# EAGLE design wemos-br1-board (EAGLE 7.7.0)
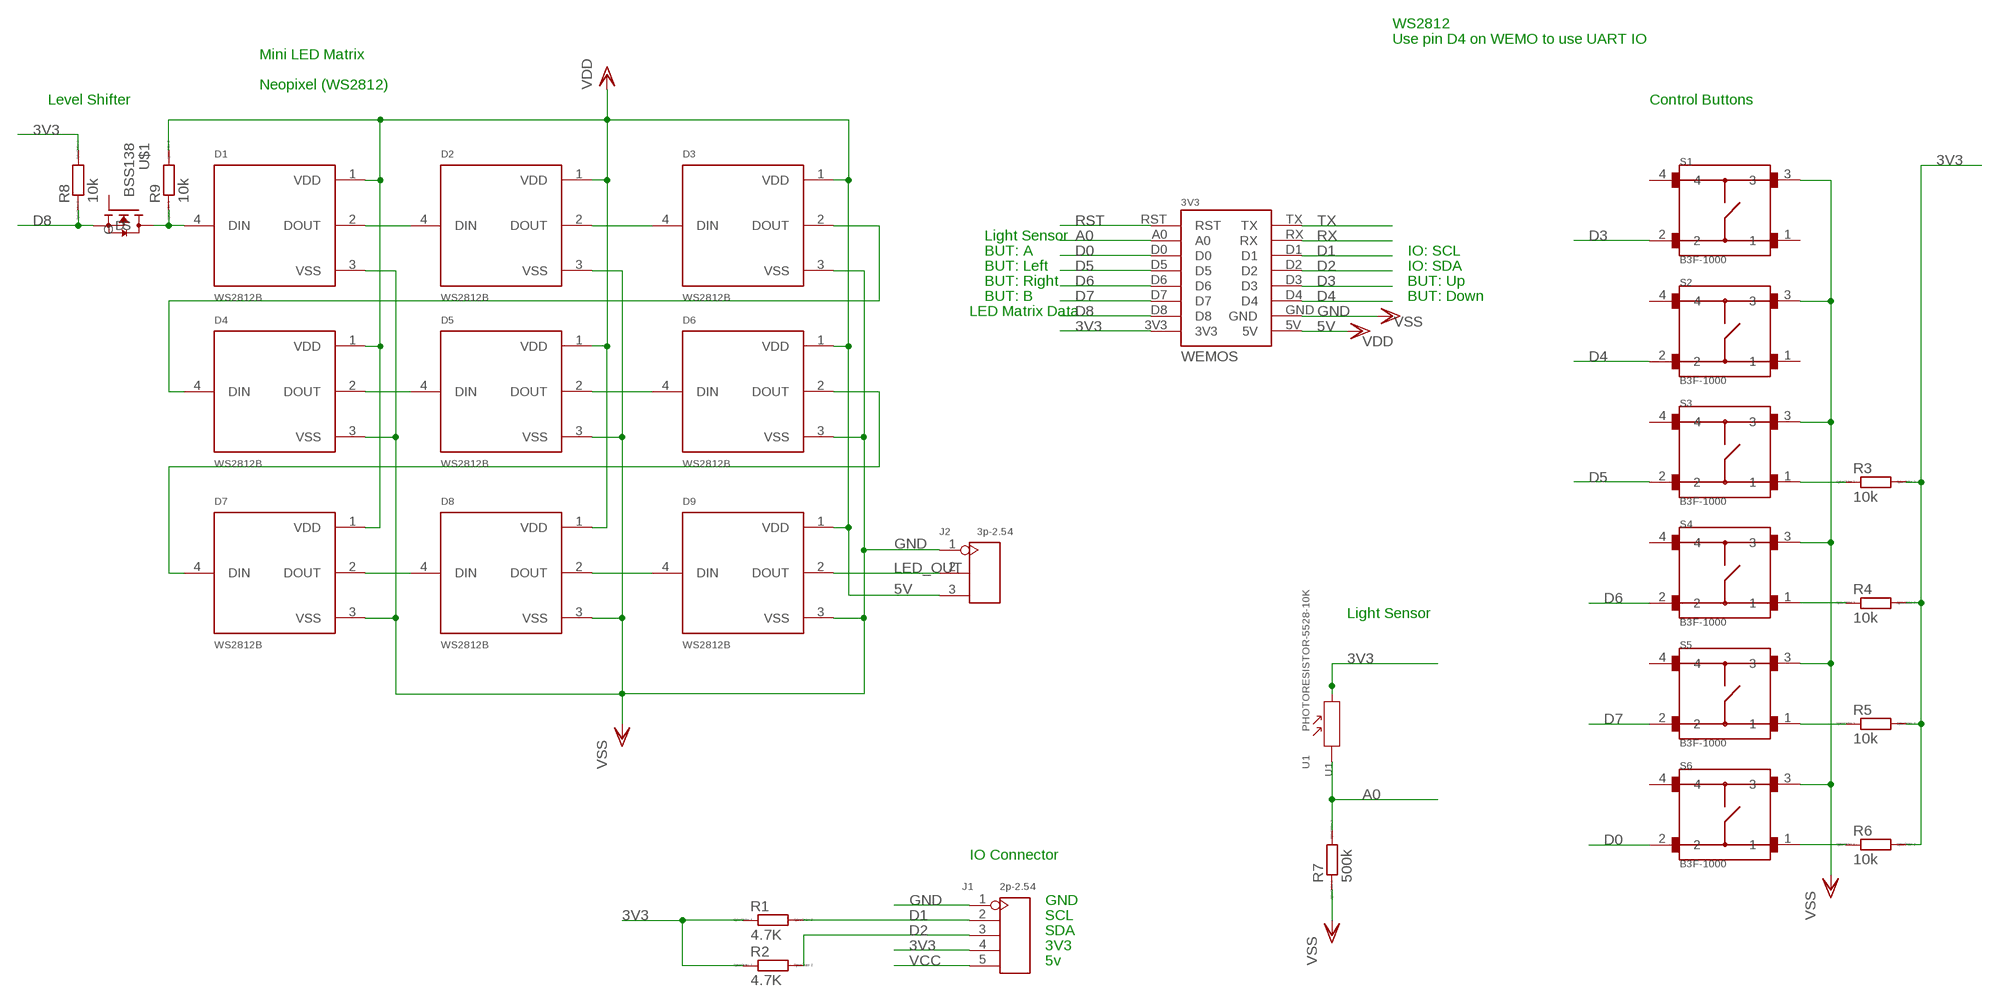
[diagram p0: schematic, sheet 1]

## Parts
3V3  WEMOS  [WEMOS]
D1  WS2812B  [LED_WS2812B]
D2  WS2812B  [LED_WS2812B]
D3  WS2812B  [LED_WS2812B]
D4  WS2812B  [LED_WS2812B]
D5  WS2812B  [LED_WS2812B]
D6  WS2812B  [LED_WS2812B]
D7  WS2812B  [LED_WS2812B]
D8  WS2812B  [LED_WS2812B]
D9  WS2812B  [LED_WS2812B]
J1  2p-2.54  DIP-BLACK-MALE-HEADER-VERT(5P-2.54)  [H5-2.54]
J2  3p-2.54  DIP-BLACK-FEMALE-HEADER-VERT(3P-2.54)  [H3-2.54]
R1  4.7K  R  [R0805]
R2  4.7K  R  [R0805]
R3  10k  R  [R0805]
R4  10k  R  [R0805]
R5  10k  R  [R0805]
R6  10k  R  [R0805]
R7  500k  R  [R0805]
R8  10k  R  [R0805]
R9  10k  R  [R0805]
S1  B3F-1000  [SW_B3F-1000]
S2  B3F-1000  [SW_B3F-1000]
S3  B3F-1000  [SW_B3F-1000]
S4  B3F-1000  [SW_B3F-1000]
S5  B3F-1000  [SW_B3F-1000]
S6  B3F-1000  [SW_B3F-1000]
U1  PHOTORESISTOR-5528-10K  PHOTORESISTOR-5528-10K(2P-5.0X4.2MM)  [SNR2-3.0]
U$1  BSS138  [BSS138]

## Nets
3V3: 3V3.3V3 J1.4 R1.1 R2.1 R3.2 R4.2 R5.2 R6.2 R8.2 U1.2
5V: 3V3.5V D1.1(VDD) D2.1(VDD) D3.1(VDD) D4.1(VDD) D5.1(VDD) D6.1(VDD) D7.1(VDD) D8.1(VDD) D9.1(VDD) J2.3 R9.2 ; supply symbol labelled VDD
A0: 3V3.A0 R7.2 U1.1
D0: 3V3.D0 S6.2
D1: 3V3.D1 J1.2 R1.2
D2: 3V3.D2 J1.3 R2.2
D3: 3V3.D3 S1.2
D4: 3V3.D4 S2.2
D5: 3V3.D5 S3.2
D6: 3V3.D6 S4.2
D7: 3V3.D7 S5.2
D8: 3V3.D8 R8.1 U$1.S
GND: 3V3.GND D1.3(VSS) D2.3(VSS) D3.3(VSS) D4.3(VSS) D5.3(VSS) D6.3(VSS) D7.3(VSS) D8.3(VSS) D9.3(VSS) J1.1 J2.1 R7.1 S1.3 S2.3 S3.3 S4.3 S5.3 S6.3 ; supply symbol labelled VSS
LED_OUT: D9.2(DOUT) J2.2
N$1: R3.1 S3.1
N$2: D1.2(DOUT) D2.4(DIN)
N$3: D2.2(DOUT) D3.4(DIN)
N$4: D3.2(DOUT) D4.4(DIN)
N$5: D4.2(DOUT) D5.4(DIN)
N$6: D5.2(DOUT) D6.4(DIN)
N$7: D6.2(DOUT) D7.4(DIN)
N$8: D7.2(DOUT) D8.4(DIN)
N$9: D8.2(DOUT) D9.4(DIN)
N$10: R4.1 S4.1
N$11: R5.1 S5.1
N$12: R6.1 S6.1
N$15: D1.4(DIN) R9.1 U$1.D
RST: 3V3.RST
RX: 3V3.RX
TX: 3V3.TX
VCC: J1.5
Unconnected: S1.1 S1.4 S2.1 S2.4 S3.4 S4.4 S5.4 S6.4 U$1.G

## Notes on the sheet
- WS2812 
  Use pin D4 on WEMO to use UART IO
- Mini LED Matrix
- Neopixel (WS2812)
- Level Shifter | Control Buttons
- Light Sensor
- BUT: A | IO: SCL
- BUT: Left | IO: SDA
- BUT: Right | BUT: Up
- BUT: B | BUT: Down
- LED Matrix Data
- Light Sensor
- IO Connector
- GND
- SCL
- SDA
- 3V3
- 5v

## Library data of the parts
3V3 = 1455413453956-wemos:WEMOS
D1-D9 = WS2812B:WS2812B: Ws2812b 5050 Rgb Led With Integrated Driver Chip Pack Of 10; AVAILABILITY: Warning; DESCRIPTION: Intelligent Control Led Integrated Light Source Pack Of 10; MF: Adafruit Industries; MP: WS2812B; PACKAGE: None; PRICE: 5.56 USD
J1 = Seeed-OPL-Connector:DIP-BLACK-MALE-HEADER-VERT(5P-2.54): 320020040
J2 = Seeed-OPL-Connector:DIP-BLACK-FEMALE-HEADER-VERT(3P-2.54): 320030024; MPN: F185-1103A0BSYA1
R1-R9 = eagle-ltspice:R: RESISTOR, European symbol; SPICEMODEL: NONE; SPICEPREFIX: R
S1-S6 = B3F-1000:B3F-1000: Switch, FLUX TIGHT MECHANICAL KEYSwitch, , 50MA@24VDC, NO GROUND TERM., FLAT PLUNG; AVAILABILITY: Good; DESCRIPTION: Switch, FLUX TIGHT MECHANICAL KEYSwitch, , 50MA@24VDC, NO GROUND TERM., FLAT PLUNG; MF: Omron; MP: B3F-1000; PACKAGE: None; PRICE: 0.23 USD
U1 = Seeed-OPL-sensor:PHOTORESISTOR-5528-10K(2P-5.0X4.2MM): 314020017; MPN: PHOTORESISTOR-5528-10K
U$1 = BSS138:BSS138: BSS138 N-Channel Logic Level Enhancement Mode Field Effect Transistor; AVAILABILITY: Good; DESCRIPTION: B138 Series 50 V 6 Ohms N-Ch Logic Level Enhancement Mode FET - SOT-23-3; MF: Fairchild Semiconductor; MP: BSS138; PACKAGE: SOT-23-3 Fairchild Semiconductor; PRICE: 0.09 USD

## Board
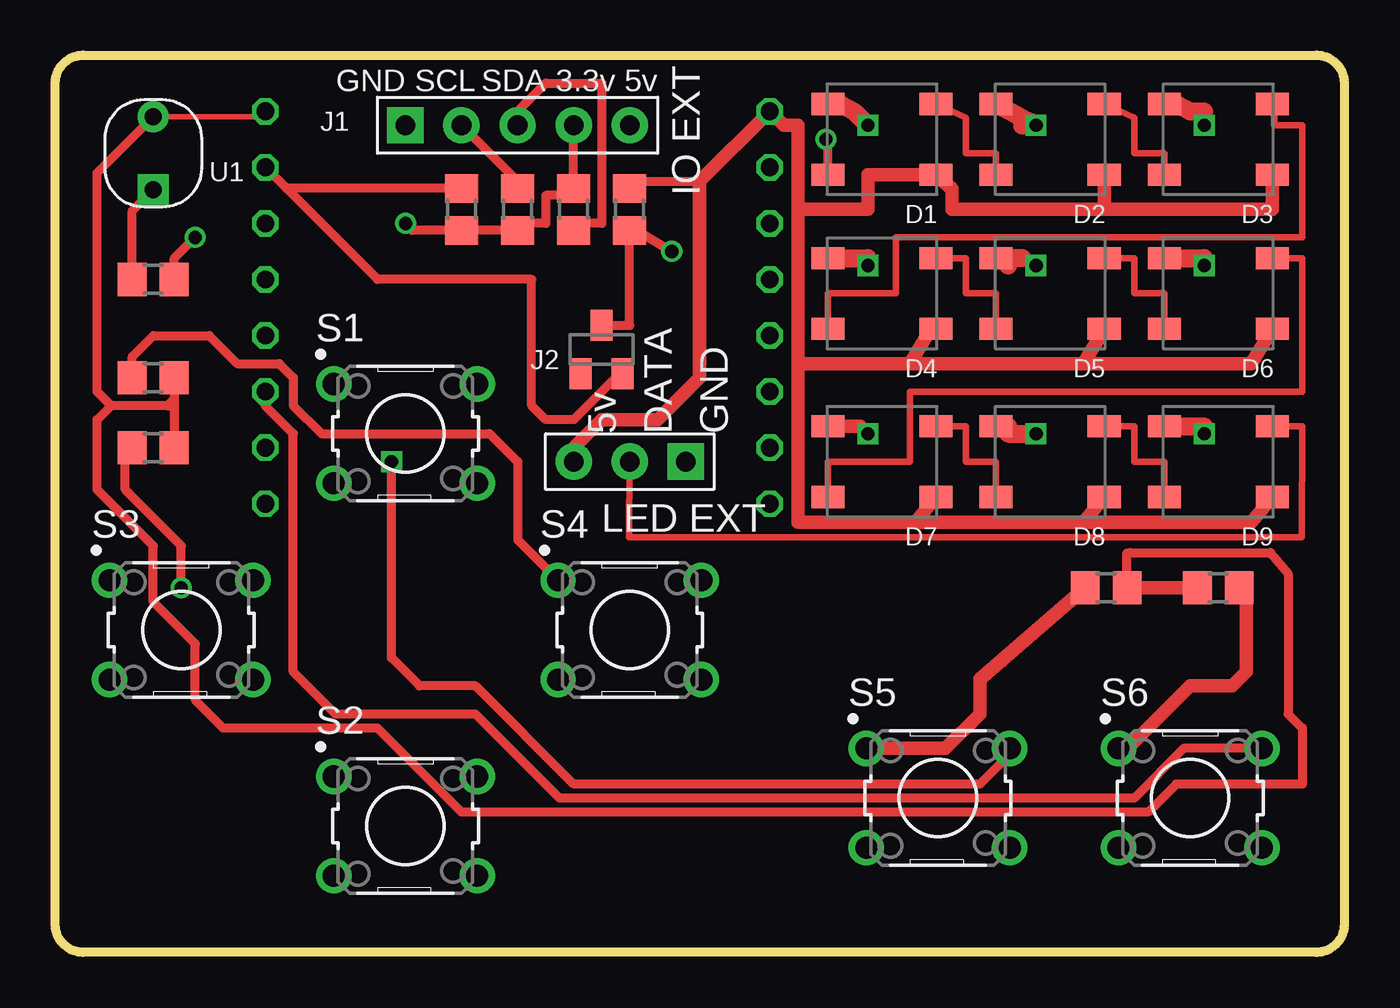
[diagram p1: board, top side]
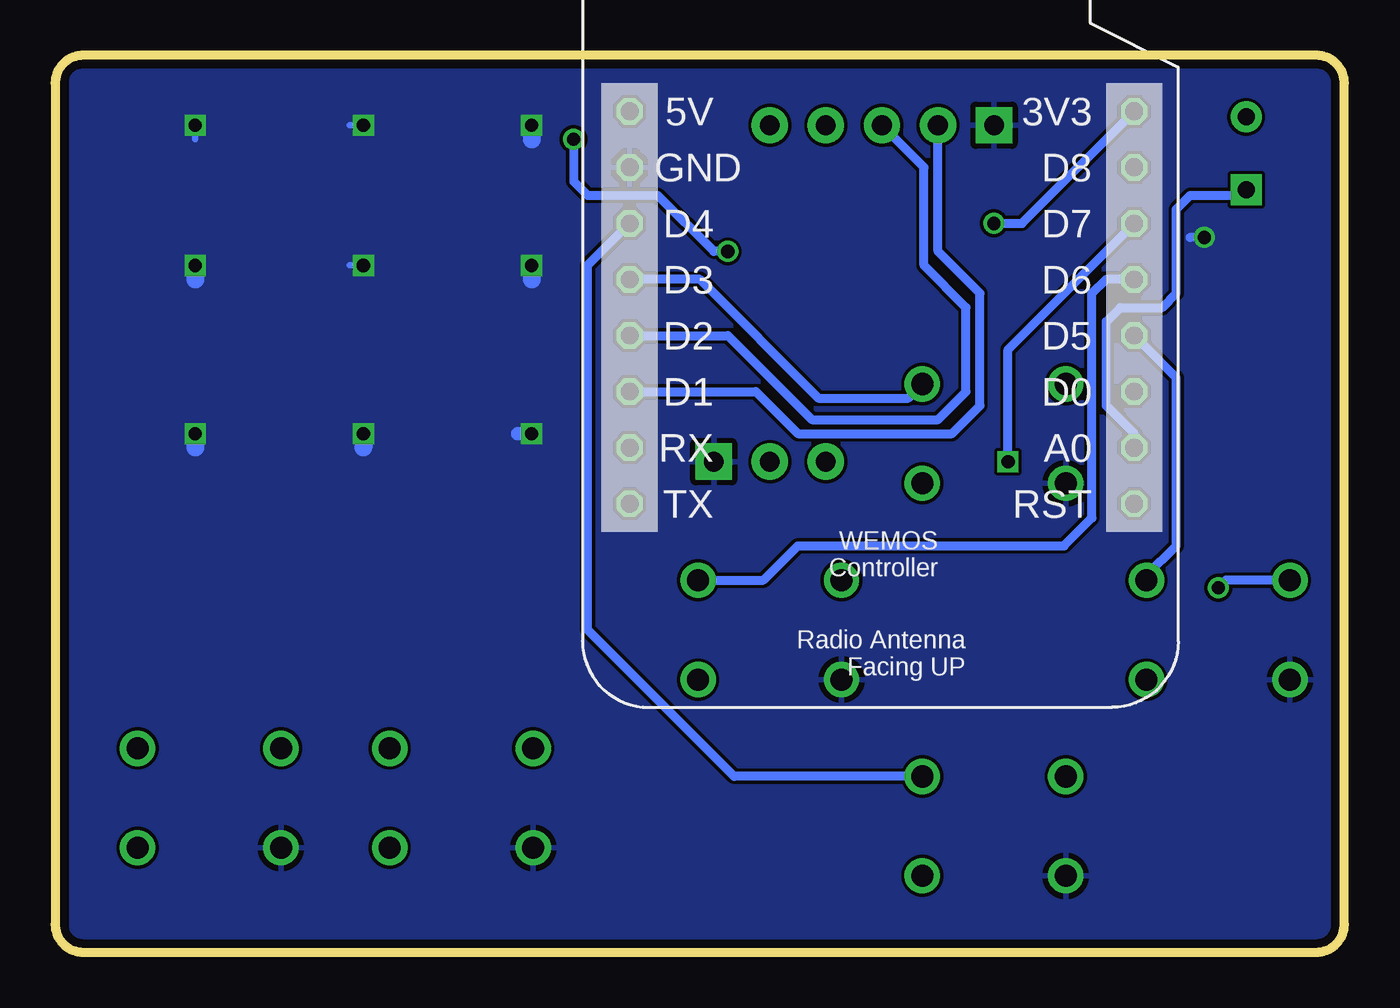
[diagram p2: board, bottom side, seen from below]

Size 58.42 x 40.64 mm. Coordinates in mm from the lower left corner, seen from the top.
Outline: 1.27,40.64 57.15,40.64 arc-90 58.42,39.37 58.42,1.27 arc-90 57.15,0 1.27,0 arc-90 0,1.27 0,39.37 arc-90 1.27,40.64
Copper layers (1*16): Top 0.0356mm / dielectric 1.5011mm / Bottom 0.0356mm
Design rules "LaenPCBOrder": minimum track width 6mil, minimum drill 13mil, track to track 6mil, track to pad 6mil, pad to pad 6mil, via to via 6mil, smd to smd 6mil, copper to edge 15mil, drill to drill 6mil, minimum pad ring 7mil, minimum via ring 7mil, stop-mask expansion 3mil, vias tented up to drill 0mil, thermal gap 10mil

### Footprints (pad centres in the part's own frame; a part is rotated, then mirrored left to right if it is on the bottom)
WEMOS = drill 0.8 octagon: 3V3 0,0; 5V 22.86,0; A0 0,15.24; D0 0,12.7; D1 22.86,12.7; D2 22.86,10.16; D3 22.86,7.62; D4 22.86,5.08; D5 0,10.16; D6 0,7.62; D7 0,5.08; D8 0,2.54; GND 22.86,2.54; RST 0,17.78; RX 22.86,15.24; TX 22.86,17.78
LED_WS2812B = smd 1.5 x 1: 1 -2.45,1.6; 2 -2.45,-1.6; 3 2.45,-1.6; 4 2.45,1.6
H5-2.54 = drill 0.889 pad 1.651 square: 1 0,5.08 | drill 0.889 pad 1.651: 2 0,2.54; 3 0,0; 4 0,-2.54; 5 0,-5.08
H3-2.54 = drill 0.889 pad 1.651 square: 1 0,2.54 | drill 0.889 pad 1.651: 2 0,0; 3 0,-2.54
R0805 = smd 1.3 x 1.5: 1 -0.95,0; 2 0.95,0
SW_B3F-1000 = drill 1 pad 1.6: 1 -3.25,2.25; 2 3.25,2.25; 3 -3.25,-2.25; 4 3.25,-2.25
SNR2-3.0 = drill 0.762 pad 1.397 square: 1 -1.651,0 | drill 0.762 pad 1.397: 2 1.651,0
BSS138 = smd 1 x 1.4: D 0,1.1; G -0.95,-1.1; S 0.95,-1.1

### Placement (x,y rotation side)
3V3  9.53,38.1 180 bottom
D1  37.47,36.83 180 top
D2  45.08,36.83 180 top
D3  52.7,36.83 180 top
D4  37.47,29.84 180 top
D5  45.08,29.84 180 top
D6  52.7,29.84 180 top
D7  37.47,22.23 180 top
D8  45.08,22.23 180 top
D9  52.7,22.23 180 top
J1  20.96,37.46 90 top
J2  26.04,22.23 270 top
R1  20.96,33.66 90 top
R2  23.5,33.66 270 top
R3  4.45,22.86 0 top
R4  4.45,26.04 0 top
R5  47.62,16.51 0 top
R6  52.7,16.51 180 top
R7  4.45,30.48 180 top
R8  18.41,33.66 270 top
R9  26.04,33.66 90 top
S1  15.88,23.5 0 top
S2  15.88,5.72 0 top
S3  5.71,14.61 0 top
S4  26.04,14.61 0 top
S5  40,6.98 0 top
S6  51.44,6.98 0 top
U1  4.45,36.2 90 top
U$1  24.77,27.3 0 top

### Tracks (layer width: path | path; a pad name or v marks a point on that pad's centre or on a via)
3V3  (via drill 0.6)
  Top 0.254: U1.2 9.53,37.85 3V3.3V3
  Top 0.406: 5.39,24.77 R4.2 5.39,25.08 5.08,24.77 | 5.39,24.77 R3.2 | R5.2 48.58,18.1 48.72,18.11 55.07,18.11 55.88,17.15 55.88,10.8 56.52,10.16 56.52,7.62 50.8,7.62 49.53,6.35 18.41,6.35 14.61,10.16 7.62,10.16 6.35,11.43 6.35,13.97 4.45,15.88 4.45,18.41 1.91,20.96 1.91,24.13 2.54,24.77 | J1.4 R2.1 23.5,34.29 22.23,34.29 22.23,33.02 20.96,33.02 R1.1 R8.2 16.19,32.71 v15.88,33.02 | 5.08,24.77 5.39,24.77 | 5.08,24.77 2.54,24.77 | 2.54,24.77 1.91,25.4 1.91,35.31 U1.2
  Top 0.61: R5.2 R6.2
  Bottom 0.406: v15.88,33.02 14.61,33.02 3V3.3V3
5V
  Top 0.406: R9.2 26.04,34.93 29.21,34.93
  Top 0.61: 47.53,33.66 40.64,33.66 40.64,34.6 D1.1 36.83,35.23 36.83,33.66 33.66,33.66 | 47.53,33.66 D2.1 | 47.53,33.66 55.16,33.66 D3.1 | 33.66,33.66 33.66,37.46 33.02,37.46 3V3.5V 29.21,34.93 29.21,26.04 27.31,24.13 24.77,24.13 23.5,22.86 J2.3 | D4.1 39.67,28.25 38.73,26.67 | 38.73,26.67 33.66,26.67 | 33.66,26.67 33.66,33.66 | 38.73,26.67 46.59,26.67 | 46.59,26.67 D5.1 | 46.59,26.67 54.22,26.67 D6.1 | 33.66,26.67 33.66,19.48 38.97,19.48 | 38.97,19.48 D7.1 | 38.97,19.48 46.59,19.48 | 46.59,19.48 D8.1 | 46.59,19.48 54.22,19.48 D9.1
A0
  Top 0.406: R7.2 3.5,33.59 U1.1
  Bottom 0.406: 3V3.A0 9.53,23.5 10.8,24.77 10.8,28.58 10.16,29.21 8.26,29.21 7.62,29.84 7.62,33.66 6.98,34.29 4.7,34.29 U1.1
D0
  Top 0.406: S6.2 51.14,9.23 48.89,6.98 22.86,6.98 19.05,10.8 12.7,10.8 10.8,12.7 10.8,23.5 9.53,24.77 3V3.D0
D1
  Top 0.406: R1.2 20.96,34.93 J1.2
  Bottom 0.406: 3V3.D1 26.67,25.4 24.77,23.5 17.78,23.5 16.51,24.77 16.51,29.84 18.41,31.75 J1.2
D2
  Top 0.406: J1.3 20.96,38.1 22.23,39.37 24.77,39.37 24.77,33.02 23.5,33.02 R2.2
  Bottom 0.406: 3V3.D2 27.94,27.94 24.13,24.13 18.41,24.13 17.14,25.4 17.14,29.21 19.05,31.12 19.05,35.56 J1.3
D3
  Bottom 0.406: 3V3.D3 29.21,30.48 23.84,25.11 19.76,25.11 S1.2
D4
  Bottom 0.406: S2.2 27.65,7.97 34.29,14.61 34.29,31.12 3V3.D4
D5
  Bottom 0.406: S3.2 8.96,17.07 7.62,18.41 7.62,26.04 3V3.D5
D6
  Bottom 0.406: S4.2 26.32,16.86 24.77,18.41 12.7,18.41 11.43,19.69 11.43,29.84 10.8,30.48 3V3.D6
D7  (via drill 0.6)
  Top 0.406: S5.2 43.25,8.97 41.91,7.62 23.5,7.62 19.05,12.07 16.51,12.07 15.24,13.34 v15.24,22.23
  Bottom 0.406: v15.24,22.23 15.24,27.3 3V3.D7
D8
  Top 0.406: R8.1 10.48,34.6 | 10.48,34.6 3V3.D8 | U$1.S 25.57,26.21 23.5,24.13 22.23,24.13 21.59,24.77 21.59,30.48 14.61,30.48 10.48,34.6
GND  (via drill 0.6)
  Top 0.305: D2.3 44.45,37.8 v44.45,37.46 | D5.3 43.81,31.45 44.45,31.45 v44.45,31.12 | D3.3 52.07,37.8 v52.07,37.46
  Top 0.406: R7.1 5.39,31.43 v6.35,32.38
  Top 0.61: D7.3 36.5,23.83 v36.83,23.5
  Top 0.813: D2.3 43.81,37.8 43.81,37.46 | D3.3 50.8,38.43 51.44,38.1 52.07,38.1 | 43.81,31.45 43.18,31.45 43.18,31.12 | D6.3 52.07,31.45 v52.07,31.12 | D4.3 36.83,31.45 v36.83,31.12 | D1.3 35.56,38.43 36.19,38.1 v36.83,37.46 | D8.3 43.18,23.83 43.18,23.5 v44.45,23.5 | D9.3 52.07,23.83 v52.07,23.5
  Bottom 0.305: v44.45,37.46 45.08,37.46 | v44.45,31.12 45.08,31.12 | v52.07,37.46 52.07,36.83
  Bottom 0.406: v6.35,32.38 6.98,32.38
  Bottom 0.61: v36.83,23.5 37.47,23.5
  Bottom 0.813: v52.07,31.12 52.07,30.48 | v36.83,31.12 36.83,30.48 | v36.83,37.46 36.83,36.83 | v44.45,23.5 44.45,22.86 | v52.07,23.5 52.07,22.86
  pour Bottom: 0.63,40.01 57.78,40.01 57.78,0.64 0.63,0.64
LED_OUT
  Top 0.305: D9.2 56.52,23.83 56.49,18.8 26.01,18.8 J2.2
N$1  (via drill 0.6)
  Top 0.406: R3.1 3.18,22.54 3.18,20.96 5.71,18.41 v5.71,16.51
  Bottom 0.406: S3.1 5.37,16.86 v5.71,16.51
N$2
  Top 0.305: D1.2 41.28,37.8 41.28,36.2 42.64,36.2 D2.4
N$3
  Top 0.305: D2.2 48.89,37.8 48.89,36.2 50.25,36.2 D3.4
N$4
  Top 0.305: D3.2 55.25,37.8 55.25,37.46 56.52,37.46 56.52,32.38 38.1,32.38 38.1,29.84 35.02,29.84 D4.4
N$5
  Top 0.305: D4.2 41.28,31.45 41.28,29.84 42.64,29.84 D5.4
N$6
  Top 0.305: D5.2 48.89,31.45 48.89,29.84 50.25,29.84 D6.4
N$7
  Top 0.305: D6.2 56.52,31.45 56.52,25.4 38.73,25.4 38.73,22.23 35.02,22.23 D7.4
N$8
  Top 0.305: D7.2 41.28,23.83 41.28,22.23 42.64,22.23 D8.4
N$9
  Top 0.305: D8.2 48.89,23.83 48.89,22.23 50.25,22.23 D9.4
N$10
  Top 0.406: R4.1 3.5,26.99 4.45,27.94 6.98,27.94 8.26,26.67 10.16,26.67 10.8,26.04 10.8,24.77 12.07,23.5 19.68,23.5 20.96,22.23 20.96,18.69 S4.1
N$11
  Top 0.61: S5.1 40.35,9.23 41.91,10.8 41.91,12.38 R5.1
N$12
  Top 0.61: S6.1 48.61,9.23 51.44,12.07 53.34,12.07 53.97,12.7 53.97,16.83 R6.1
N$15  (via drill 0.6)
  Top 0.406: U$1.D 26.04,28.41 R9.1 26.35,32.71 v27.94,31.75 | D1.4 35.02,36.74 v34.92,36.83
  Bottom 0.406: v27.94,31.75 28.57,31.75 31.11,34.29 34.29,34.29 34.92,34.93 v34.92,36.83

### Text on the board
tNames: GND | SCL | SDA | 3.3v | 5v | IO EXT | 5v | DATA | GND | LED EXT